# Altium project MiniPDC.PrjPcb
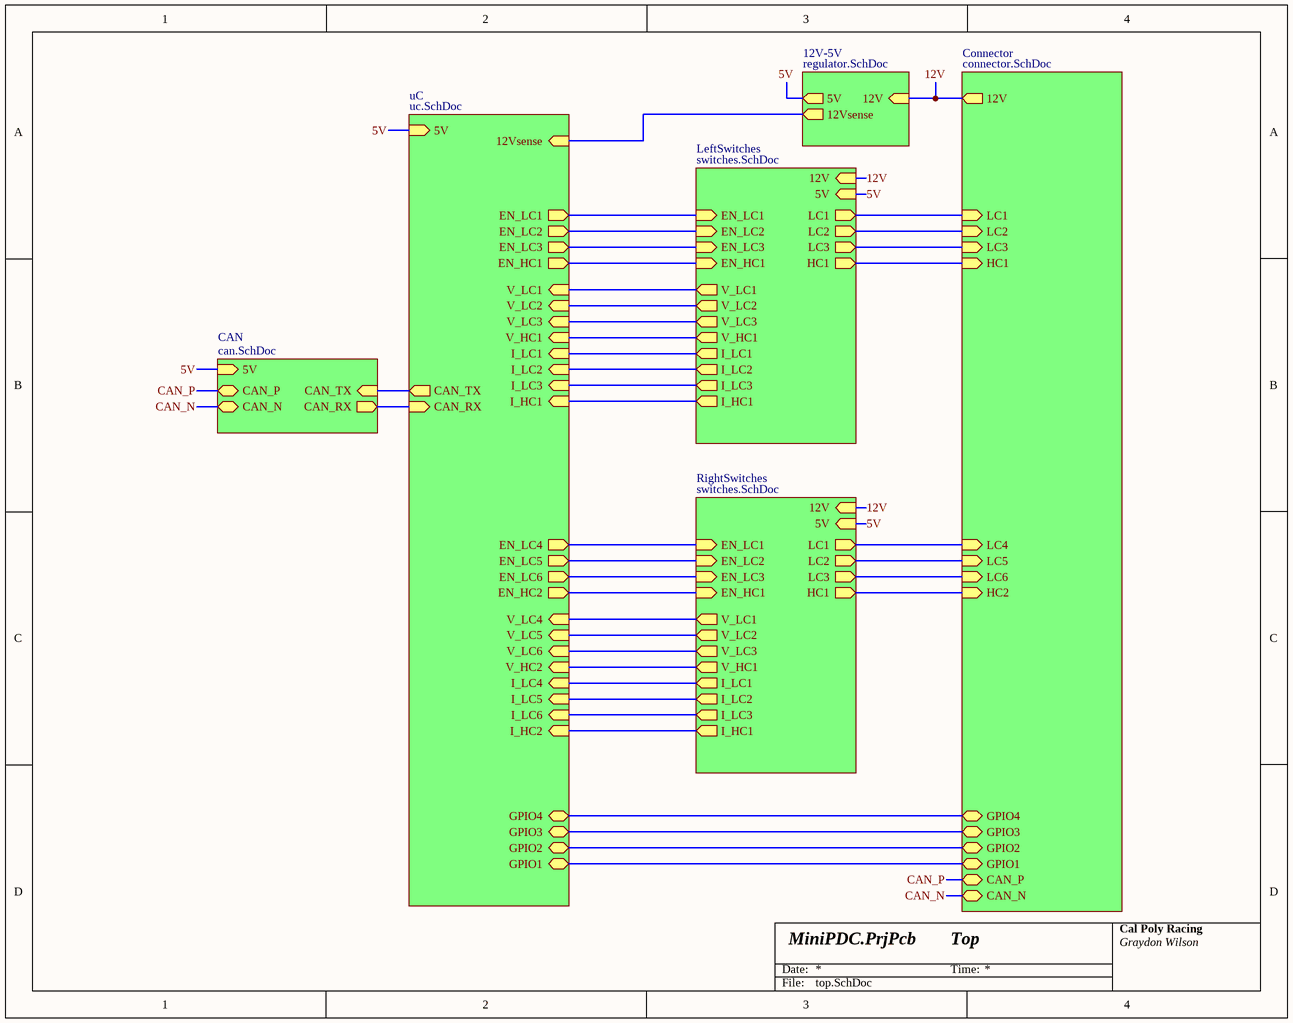
[diagram p0: top.SchDoc]
7 sheets, 120 parts. Net scope: hierarchical (ports join the sheet entries above them; power ports are global).
Board file: rev1_0.PcbDoc
Sheets:
  top.SchDoc
    CAN = can.SchDoc
    uC = uc.SchDoc
    LeftSwitches = switches.SchDoc
      Switch1 = switch.SchDoc
      Switch2 = switch.SchDoc
      Switch3 = switch.SchDoc
      Switch4 = switch.SchDoc
    Connector = connector.SchDoc
    12V-5V = regulator.SchDoc
    RightSwitches = switches.SchDoc
      Switch1 = switch.SchDoc
      Switch2 = switch.SchDoc
      Switch3 = switch.SchDoc
      Switch4 = switch.SchDoc

## Sheet top.SchDoc: Top
size A; Organization: Cal Poly Racing; engineer1: Graydon Wilson

### Sub-sheets
12V-5V = regulator.SchDoc: 12V (in), 5V (out), 12Vsense (out)
CAN = can.SchDoc: 5V (in), CAN_P (bidir), CAN_N (bidir), CAN_TX (in), CAN_RX (out)
Connector = connector.SchDoc: 12V (out), LC1 (in), LC2 (in), LC3 (in), HC1 (in), CAN_P (bidir), CAN_N (bidir), LC4 (in), LC5 (in), LC6 (in), HC2 (in), GPIO4 (bidir), GPIO2 (bidir), GPIO1 (bidir), GPIO3 (bidir)
LeftSwitches = switches.SchDoc: LC1 (out), LC2 (out), LC3 (out), HC1 (out), I_LC1 (out), I_LC2 (out), I_LC3 (out), I_HC1 (out), V_HC1 (out), V_LC3 (out), V_LC2 (out), V_LC1 (out), EN_LC1 (in), EN_LC2 (in), EN_LC3 (in), EN_HC1 (in), 12V (in), 5V (in)
RightSwitches = switches.SchDoc: LC1 (out), LC2 (out), LC3 (out), HC1 (out), I_LC1 (out), I_LC2 (out), I_LC3 (out), I_HC1 (out), V_HC1 (out), V_LC3 (out), V_LC2 (out), V_LC1 (out), EN_LC1 (in), EN_LC2 (in), EN_LC3 (in), EN_HC1 (in), 12V (in), 5V (in)
uC = uc.SchDoc: CAN_TX (out), 5V (in), CAN_RX (in), EN_LC1 (out), EN_LC2 (out), EN_LC3 (out), EN_HC1 (out), V_LC1 (in), V_LC2 (in), V_LC3 (in), V_HC1 (in), I_LC1 (in), I_LC2 (in), I_LC3 (in), I_HC1 (in), EN_LC4 (out), EN_LC5 (out), EN_LC6 (out), EN_HC2 (out), V_LC4 (in), V_LC5 (in), V_LC6 (in), V_HC2 (in), I_LC4 (in), I_LC5 (in), I_LC6 (in), I_HC2 (in), GPIO1 (bidir), GPIO2 (bidir), GPIO3 (bidir), GPIO4 (bidir), 12Vsense (in)

### Nets
5V: sheet CAN/5V, sheet uC/5V, sheet LeftSwitches/5V, sheet 12V-5V/5V, sheet RightSwitches/5V
12V: sheet LeftSwitches/12V, sheet Connector/12V, sheet 12V-5V/12V, sheet RightSwitches/12V
CAN_N: sheet CAN/CAN_N, sheet Connector/CAN_N
CAN_P: sheet CAN/CAN_P, sheet Connector/CAN_P
NetQ1_1: sheet LeftSwitches/LC1, sheet Connector/LC1
NetQ2_1: sheet Connector/LC4, sheet RightSwitches/LC1
NetQ3_1: sheet LeftSwitches/LC2, sheet Connector/LC2
NetQ4_1: sheet Connector/LC5, sheet RightSwitches/LC2
NetQ5_1: sheet LeftSwitches/LC3, sheet Connector/LC3
NetQ6_1: sheet Connector/LC6, sheet RightSwitches/LC3
NetQ7_1: sheet LeftSwitches/HC1, sheet Connector/HC1
NetQ8_1: sheet Connector/HC2, sheet RightSwitches/HC1
NetR3_2: sheet uC/I_LC1, sheet LeftSwitches/I_LC1
NetR7_1: sheet uC/V_LC1, sheet LeftSwitches/V_LC1
NetR10_2: sheet uC/I_LC4, sheet RightSwitches/I_LC1
NetR14#2_1: sheet uC/V_LC4, sheet RightSwitches/V_LC1
NetR15#1_1: sheet uC/12Vsense, sheet 12V-5V/12Vsense
NetR17_2: sheet uC/I_LC2, sheet LeftSwitches/I_LC2
NetR21_1: sheet uC/V_LC2, sheet LeftSwitches/V_LC2
NetR24_2: sheet uC/I_LC5, sheet RightSwitches/I_LC2
NetR28_1: sheet uC/V_LC5, sheet RightSwitches/V_LC2
NetR31_2: sheet uC/I_LC3, sheet LeftSwitches/I_LC3
NetR35_1: sheet uC/V_LC3, sheet LeftSwitches/V_LC3
NetR38_2: sheet uC/I_LC6, sheet RightSwitches/I_LC3
NetR42_1: sheet uC/V_LC6, sheet RightSwitches/V_LC3
NetR45_2: sheet uC/I_HC1, sheet LeftSwitches/I_HC1
NetR49_1: sheet uC/V_HC1, sheet LeftSwitches/V_HC1
NetR52_2: sheet uC/I_HC2, sheet RightSwitches/I_HC1
NetR56_1: sheet uC/V_HC2, sheet RightSwitches/V_HC1
NetR58_2: sheet uC/EN_LC1, sheet LeftSwitches/EN_LC1
NetR59_2: sheet uC/EN_LC2, sheet LeftSwitches/EN_LC2
NetR60_2: sheet uC/EN_LC3, sheet LeftSwitches/EN_LC3
NetR61_2: sheet uC/EN_HC1, sheet LeftSwitches/EN_HC1
NetR62_2: sheet uC/EN_LC4, sheet RightSwitches/EN_LC1
NetR63_2: sheet uC/EN_LC5, sheet RightSwitches/EN_LC2
NetR64_2: sheet uC/EN_LC6, sheet RightSwitches/EN_LC3
NetR65_2: sheet uC/EN_HC2, sheet RightSwitches/EN_HC1
NetU4#1_1: sheet CAN/CAN_TX, sheet uC/CAN_TX
NetU4#1_4: sheet CAN/CAN_RX, sheet uC/CAN_RX
NetU5#1_49: sheet uC/GPIO1, sheet Connector/GPIO1
NetU5#1_50: sheet uC/GPIO2, sheet Connector/GPIO2
NetU5#1_51: sheet uC/GPIO3, sheet Connector/GPIO3
NetU5#1_52: sheet uC/GPIO4, sheet Connector/GPIO4

### Notes on the sheet
- Date:
- Time:
- File:

## Sheet can.SchDoc: CAN
size A; Organization: Cal Poly Racing; engineer1: Graydon Wilson
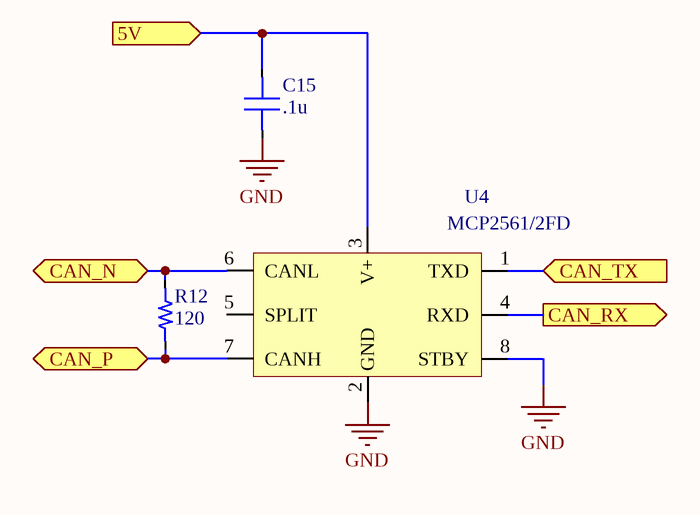
[diagram p1: can.SchDoc]

### Parts
(Parts that share a designator on the sheet are numbered #1, #2 ... from top to bottom, then left to right.)
C15#1  value .1u  [0603_CAP]  (hidden comment: Capacitor)
R12#1  value 120  [0603_RES]  (hidden comment: Resistor)
U4#1  MCP2561/2FD  [SOIC-8]

### Ports
5V (in), CAN_N (bidir), CAN_P (bidir), CAN_RX (out), CAN_TX (in)

### Nets
GND: C15#1.2 U4#1.2(GND) U4#1.8(STBY)
5V: C15#1.1 U4#1.3(V+) ; port 5V
CAN_N: R12#1.2 U4#1.6(CANL) ; port CAN_N
CAN_P: R12#1.1 U4#1.7(CANH) ; port CAN_P
NetU4#1_1: U4#1.1(TXD) ; port CAN_TX
NetU4#1_4: U4#1.4(RXD) ; port CAN_RX

Not connected (* = marked no-connect by the designer): U4#1 5(SPLIT)

### Notes on the sheet
- Date:
- Time:
- File:

### Library data of the parts
U4#1 = MCP2561/2FD: 1/1 Transceiver CANbus; Vcc: 5; Name: MCP2561/2FD; Type: CAN; ComponentLink1Description: Digikey; ComponentLink1URL: https://www.digikey.com/product-detail/en/microchip-technology/MCP2561FDT-E-SN/MCP2561FDT-E-SNCT-ND/8637243; ComponentLink2Description: Datasheet; ComponentLink2URL: http://ww1.microchip.com/downloads/en/DeviceDoc/20005284A.pdf
R12 = Resistor: Tolerance: *

## Sheet uc.SchDoc: Controller
size A; Organization: Cal Poly Racing; engineer1: Graydon Wilson
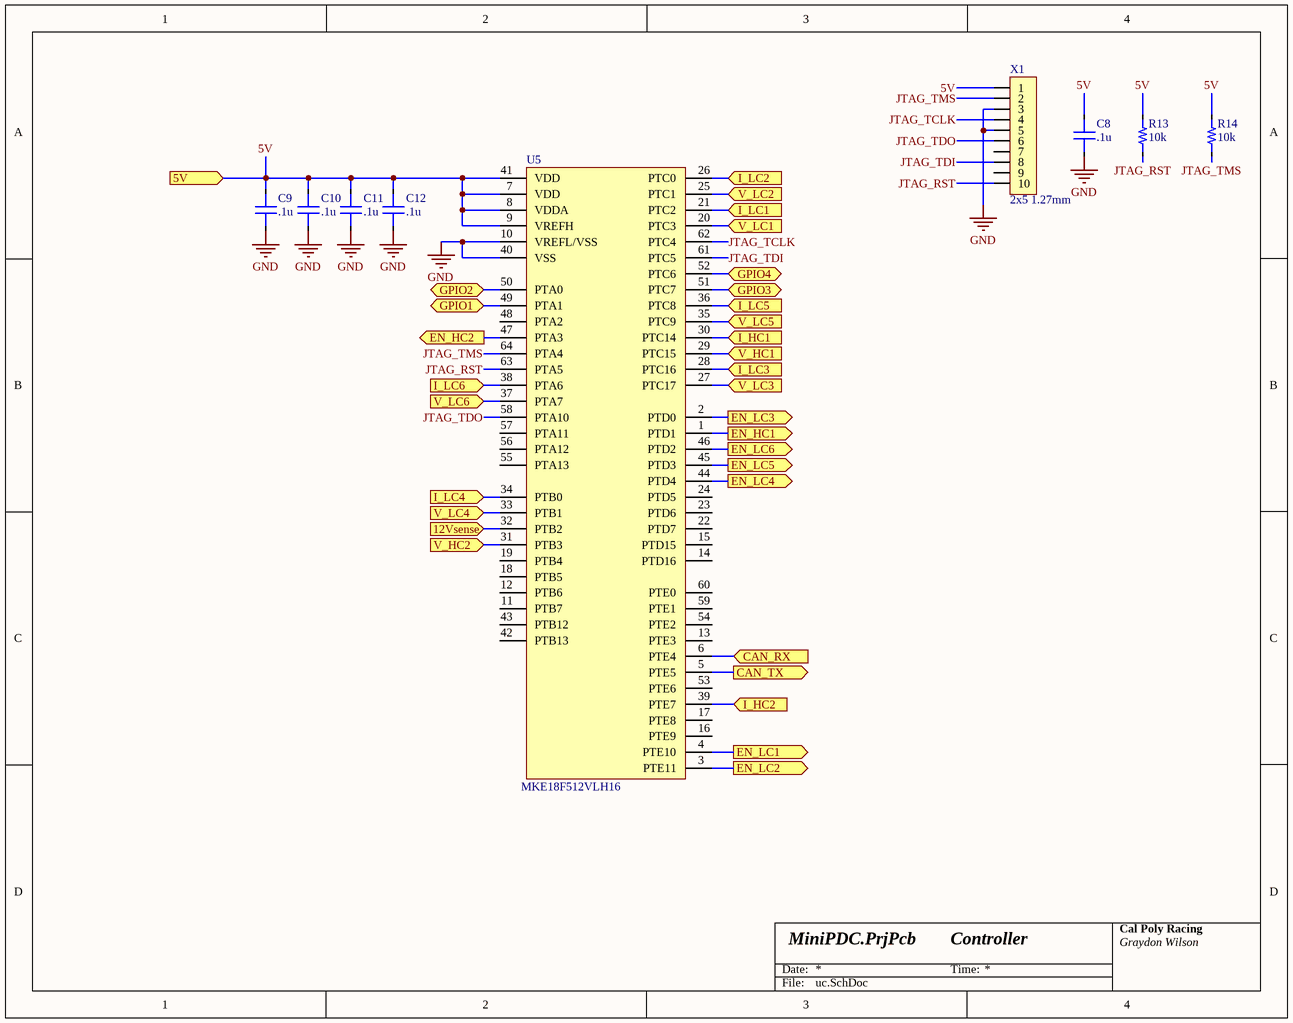
[diagram p2: uc.SchDoc]

### Parts
(Parts that share a designator on the sheet are numbered #1, #2 ... from top to bottom, then left to right.)
C8#1  value .1u  [0603_CAP]  (hidden comment: Capacitor)
C9#1  value .1u  [0603_CAP]  (hidden comment: Capacitor)
C10#1  value .1u  [0603_CAP]  (hidden comment: Capacitor)
C11#1  value .1u  [0603_CAP]  (hidden comment: Capacitor)
C12#1  value .1u  [0603_CAP]  (hidden comment: Capacitor)
R13#1  value 10k  [0603_RES]  (hidden comment: Resistor)
R14#1  value 10k  [0603_RES]  (hidden comment: Resistor)
U5#1  MKE18F512VLH16  [TQFP64]
X1  2x5 1.27mm  [2x5 1.27mm th]

### Ports
5V (in), 12Vsense (in), CAN_RX (in), CAN_TX (out), EN_HC1 (out), EN_HC2 (out), EN_LC1 (out), EN_LC2 (out), EN_LC3 (out), EN_LC4 (out), EN_LC5 (out), EN_LC6 (out), GPIO1 (bidir), GPIO2 (bidir), GPIO3 (bidir), GPIO4 (bidir), I_HC1 (in), I_HC2 (in), I_LC1 (in), I_LC2 (in), I_LC3 (in), I_LC4 (in), I_LC5 (in), I_LC6 (in), V_HC1 (in), V_HC2 (in), V_LC1 (in), V_LC2 (in), V_LC3 (in), V_LC4 (in), V_LC5 (in), V_LC6 (in)

### Nets
GND: C8#1.1 C9#1.1 C10#1.1 C11#1.1 C12#1.1 U5#1.10(VREFL/VSS) U5#1.40(VSS) X1.3 X1.5
5V: C8#1.2 C9#1.2 C10#1.2 C11#1.2 C12#1.2 R13#1.2 R14#1.2 U5#1.7(VDD) U5#1.8(VDDA) U5#1.9(VREFH) U5#1.41(VDD) X1.1 ; port 5V
JTAG_RST: R13#1.1 U5#1.63(PTA5) X1.10
JTAG_TCLK: U5#1.62(PTC4) X1.4
JTAG_TDI: U5#1.61(PTC5) X1.8
JTAG_TDO: U5#1.58(PTA10) X1.6
JTAG_TMS: R14#1.1 U5#1.64(PTA4) X1.2
NetR3_2: U5#1.21(PTC2) ; port I_LC1
NetR7_1: U5#1.20(PTC3) ; port V_LC1
NetR10_2: U5#1.34(PTB0) ; port I_LC4
NetR14#2_1: U5#1.33(PTB1) ; port V_LC4
NetR15#1_1: U5#1.32(PTB2) ; port 12Vsense
NetR17_2: U5#1.26(PTC0) ; port I_LC2
NetR21_1: U5#1.25(PTC1) ; port V_LC2
NetR24_2: U5#1.36(PTC8) ; port I_LC5
NetR28_1: U5#1.35(PTC9) ; port V_LC5
NetR31_2: U5#1.28(PTC16) ; port I_LC3
NetR35_1: U5#1.27(PTC17) ; port V_LC3
NetR38_2: U5#1.38(PTA6) ; port I_LC6
NetR42_1: U5#1.37(PTA7) ; port V_LC6
NetR45_2: U5#1.30(PTC14) ; port I_HC1
NetR49_1: U5#1.29(PTC15) ; port V_HC1
NetR52_2: U5#1.39(PTE7) ; port I_HC2
NetR56_1: U5#1.31(PTB3) ; port V_HC2
NetR58_2: U5#1.4(PTE10) ; port EN_LC1
NetR59_2: U5#1.3(PTE11) ; port EN_LC2
NetR60_2: U5#1.2(PTD0) ; port EN_LC3
NetR61_2: U5#1.1(PTD1) ; port EN_HC1
NetR62_2: U5#1.44(PTD4) ; port EN_LC4
NetR63_2: U5#1.45(PTD3) ; port EN_LC5
NetR64_2: U5#1.46(PTD2) ; port EN_LC6
NetR65_2: U5#1.47(PTA3) ; port EN_HC2
NetU4#1_1: U5#1.5(PTE5) ; port CAN_TX
NetU4#1_4: U5#1.6(PTE4) ; port CAN_RX
NetU5#1_49: U5#1.49(PTA1) ; port GPIO1
NetU5#1_50: U5#1.50(PTA0) ; port GPIO2
NetU5#1_51: U5#1.51(PTC7) ; port GPIO3
NetU5#1_52: U5#1.52(PTC6) ; port GPIO4

Not connected (* = marked no-connect by the designer): U5#1 11(PTB7) 12(PTB6) 13(PTE3) 14(PTD16) 15(PTD15) 16(PTE9) 17(PTE8) 18(PTB5) 19(PTB4) 22(PTD7) 23(PTD6) 24(PTD5) 42(PTB13) 43(PTB12) 48(PTA2) 53(PTE6) 54(PTE2) 55(PTA13) 56(PTA12) 57(PTA11) 59(PTE1) 60(PTE0); X1 7 9

### Notes on the sheet
- Date:
- Time:
- File:

### Library data of the parts
U5#1 = MKE18F512VLH16: Vcc: 2.7-5.5; Package: TQFP64
X1 = 2x5 1.27mm: Circuits: 10; Name: 2x5 1.27mm; ComponentLink1Description: Digikey; ComponentLink1URL: https://www.digikey.com/product-detail/en/samtec-inc/FTSH-105-01-F-D-K/SAM8909-ND/1850757
C8-C12 = Capacitor: Dielectric: *; Percent Tolerance: *; ESR: *
R13 R14 = Resistor: Tolerance: *

## Sheet switches.SchDoc: Quad Switch
size A; Organization: Cal Poly Racing; engineer1: Graydon Wilson
Used 2 times, as channels LeftSwitches, RightSwitches. Parts and nets are listed once, with the designators drawn on the sheet.
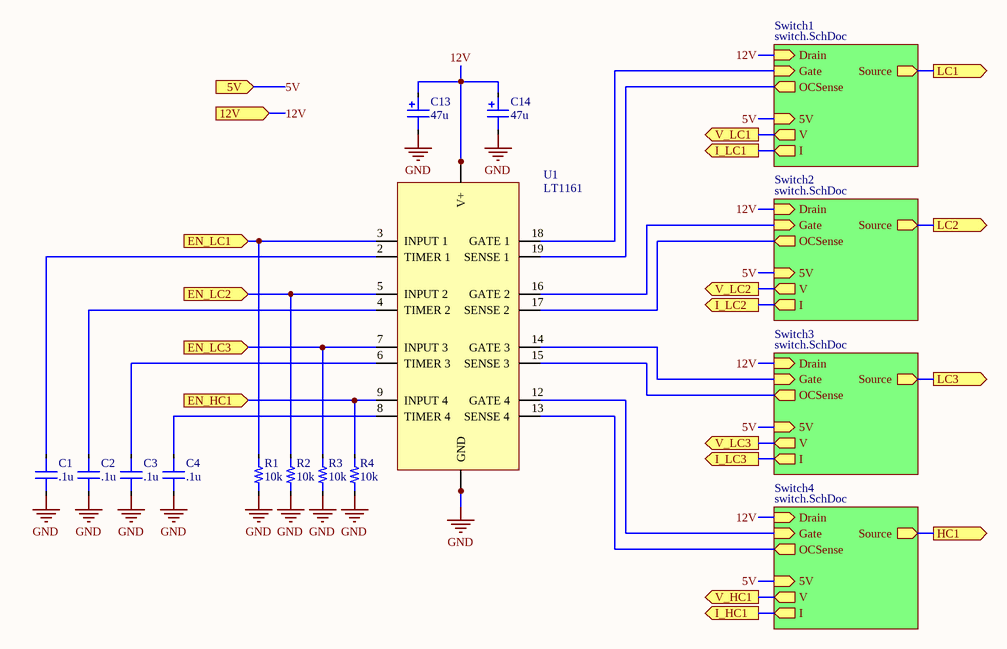
[diagram p3: switches.SchDoc]

### Parts
C1  value .1u  [0603_CAP]  (hidden comment: Capacitor)
C2  value .1u  [0603_CAP]  (hidden comment: Capacitor)
C3  value .1u  [0603_CAP]  (hidden comment: Capacitor)
C4  value .1u  [0603_CAP]  (hidden comment: Capacitor)
C13  value 47u  [CAPAE6666X77M]  (hidden comment: UWT1H470MCL1GS)
C14  value 47u  [CAPAE6666X77M]  (hidden comment: UWT1H470MCL1GS)
R1  value 10k  [0603_RES]  (hidden comment: Resistor)
R2  value 10k  [0603_RES]  (hidden comment: Resistor)
R3  value 10k  [0603_RES]  (hidden comment: Resistor)
R4  value 10k  [0603_RES]  (hidden comment: Resistor)
U1  LT1161  [SO-20]

### Sub-sheets
Switch1 = switch.SchDoc: 5V (in), I (out), V (out), OCSense (out), Gate (in), Drain (in), Source (out)
Switch2 = switch.SchDoc: 5V (in), I (out), V (out), OCSense (out), Gate (in), Drain (in), Source (out)
Switch3 = switch.SchDoc: 5V (in), I (out), V (out), OCSense (out), Gate (in), Drain (in), Source (out)
Switch4 = switch.SchDoc: 5V (in), I (out), V (out), OCSense (out), Gate (in), Drain (in), Source (out)

### Ports
5V (in), 12V (in), EN_HC1 (in), EN_LC1 (in), EN_LC2 (in), EN_LC3 (in), HC1 (out), I_HC1 (out), I_LC1 (out), I_LC2 (out), I_LC3 (out), LC1 (out), LC2 (out), LC3 (out), V_HC1 (out), V_LC1 (out), V_LC2 (out), V_LC3 (out)

### Nets
GND: C1.1 C2.1 C3.1 C4.1 C13.2 C14.2 R1.1 R2.1 R3.1 R4.1 U1.1(GND) U1.10(GND)
5V: port 5V, sheet Switch1/5V, sheet Switch2/5V, sheet Switch3/5V, sheet Switch4/5V
12V: C13.1 C14.1 U1.11(V+) U1.20(V+) ; port 12V, sheet Switch1/Drain, sheet Switch2/Drain, sheet Switch3/Drain, sheet Switch4/Drain
EN_HC1: R4.2 U1.9(INPUT_4) ; port EN_HC1
EN_LC1: R1.2 U1.3(INPUT_1) ; port EN_LC1
EN_LC2: R2.2 U1.5(INPUT_2) ; port EN_LC2
EN_LC3: R3.2 U1.7(INPUT_3) ; port EN_LC3
HC1: port HC1, sheet Switch4/Source
I_HC1: port I_HC1, sheet Switch4/I
I_LC1: port I_LC1, sheet Switch1/I
I_LC2: port I_LC2, sheet Switch2/I
I_LC3: port I_LC3, sheet Switch3/I
LC1: port LC1, sheet Switch1/Source
LC2: port LC2, sheet Switch2/Source
LC3: port LC3, sheet Switch3/Source
V_HC1: port V_HC1, sheet Switch4/V
V_LC1: port V_LC1, sheet Switch1/V
V_LC2: port V_LC2, sheet Switch2/V
V_LC3: port V_LC3, sheet Switch3/V
NetC1_2: C1.2 U1.2(TIMER_1)
NetC2_2: C2.2 U1.4(TIMER_2)
NetC3_2: C3.2 U1.6(TIMER_3)
NetC4_2: C4.2 U1.8(TIMER_4)
NetU1_12: U1.12(GATE_4) ; sheet Switch4/Gate
NetU1_13: U1.13(SENSE_4) ; sheet Switch4/OCSense
NetU1_14: U1.14(GATE_3) ; sheet Switch3/Gate
NetU1_15: U1.15(SENSE_3) ; sheet Switch3/OCSense
NetU1_16: U1.16(GATE_2) ; sheet Switch2/Gate
NetU1_17: U1.17(SENSE_2) ; sheet Switch2/OCSense
NetU1_18: U1.18(GATE_1) ; sheet Switch1/Gate
NetU1_19: U1.19(SENSE_1) ; sheet Switch1/OCSense

### Channels
LeftSwitches: designators C1=C14 C2=C15#2 C3=C16 C4=C17 C13=C12#2 C14=C13 R1=R58 R2=R59 R3=R60 R4=R61 U1=U11; ports 5V=5V 12V=12V EN_HC1=NetR61_2 EN_LC1=NetR58_2 EN_LC2=NetR59_2 EN_LC3=NetR60_2 HC1=NetQ7_1 I_HC1=NetR45_2 I_LC1=NetR3_2 I_LC2=NetR17_2 I_LC3=NetR31_2 LC1=NetQ1_1 LC2=NetQ3_1 LC3=NetQ5_1 V_HC1=NetR49_1 V_LC1=NetR7_1 V_LC2=NetR21_1 V_LC3=NetR35_1
RightSwitches: designators C1=C20 C2=C21 C3=C22 C4=C23 C13=C18 C14=C19 R1=R62 R2=R63 R3=R64 R4=R65 U1=U12; ports 5V=5V 12V=12V EN_HC1=NetR65_2 EN_LC1=NetR62_2 EN_LC2=NetR63_2 EN_LC3=NetR64_2 HC1=NetQ8_1 I_HC1=NetR52_2 I_LC1=NetR10_2 I_LC2=NetR24_2 I_LC3=NetR38_2 LC1=NetQ2_1 LC2=NetQ4_1 LC3=NetQ6_1 V_HC1=NetR56_1 V_LC1=NetR14#2_1 V_LC2=NetR28_1 V_LC3=NetR42_1

### Notes on the sheet
- Date:
- Time:
- File:

### Library data of the parts
C13 C14 = UWT1H470MCL1GS: CAP ALUM 47UF 20% 50V SMD; Dielectric: Aluminum Electrolytic; Vmax: 50; Percent Tolerance: 20%
C1-C4 = Capacitor: Dielectric: *; Percent Tolerance: *; ESR: *
R1-R4 = Resistor: Tolerance: *
U1 = LT1161: Name: LT1161; ComponentLink1Description: Datasheet; ComponentLink1URL: https://www.analog.com/media/en/technical-documentation/data-sheets/1161fa.pdf; ComponentLink2Description: Digikey; ComponentLink2URL: https://www.digikey.com/product-detail/en/linear-technology-analog-devices/LT1161ISW-PBF/LT1161ISW-PBF-ND/888528

## Sheet switch.SchDoc: High Side Switch
size A; Organization: Cal Poly Racing; engineer1: Graydon Wilson
Used 8 times, as channels LeftSwitches/Switch1, LeftSwitches/Switch2, LeftSwitches/Switch3, LeftSwitches/Switch4, RightSwitches/Switch1, RightSwitches/Switch2, RightSwitches/Switch3, RightSwitches/Switch4. Parts and nets are listed once, with the designators drawn on the sheet.
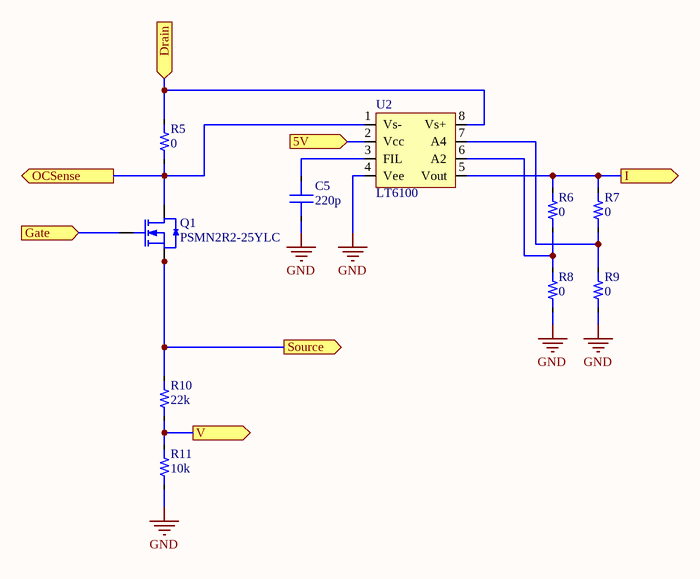
[diagram p4: switch.SchDoc]

### Parts
C5  value 220p  [0603_CAP]  (hidden comment: Capacitor)
Q1  PSMN2R2-25YLC  [LFPAK-SO8]
R5  value 0  [2010]  (hidden comment: Resistor)
R6  value 0  [0603_RES]  (hidden comment: Resistor)
R7  value 0  [0603_RES]  (hidden comment: Resistor)
R8  value 0  [0603_RES]  (hidden comment: Resistor)
R9  value 0  [0603_RES]  (hidden comment: Resistor)
R10  value 22k  [0603_RES]  (hidden comment: Resistor)
R11  value 10k  [0603_RES]  (hidden comment: Resistor)
U2  LT6100  [MSOP-8]

### Ports
5V (in), Drain (in), Gate (in), I (out), OCSense (out), Source (out), V (out)

### Nets
GND: C5.1 R8.1 R9.1 R11.1 U2.4(Vee)
5V: U2.2(Vcc) ; port 5V
Drain: R5.2 U2.8(Vs+) ; port Drain
Gate: Q1.4(G) ; port Gate
I: R6.2 R7.2 U2.5(Vout) ; port I
OCSense: Q1.5(D) R5.1 U2.1(Vs-) ; port OCSense
Source: Q1.1(S) Q1.2(S) Q1.3(S) R10.2 ; port Source
V: R10.1 R11.2 ; port V
NetC5_2: C5.2 U2.3(FIL)
NetR6_1: R6.1 R8.2 U2.6(A2)
NetR7_1: R7.1 R9.2 U2.7(A4)

### Channels
LeftSwitches/Switch1: designators C5=C4 Q1=Q1 R5=R2 R6=R3 R7=R4 R8=R5 R9=R6 R10=R7 R11=R8 U2=U3#1; ports 5V=5V Drain=12V Gate=NetQ1_4 I=NetR3_2 OCSense=NetQ1_5 Source=NetQ1_1 V=NetR7_1
LeftSwitches/Switch2: designators C5=C6#1 Q1=Q3 R5=R16#1 R6=R17 R7=R18 R8=R19 R9=R20 R10=R21 R11=R22 U2=U5#2; ports 5V=5V Drain=12V Gate=NetQ3_4 I=NetR17_2 OCSense=NetQ3_5 Source=NetQ3_1 V=NetR21_1
LeftSwitches/Switch3: designators C5=C8#2 Q1=Q5 R5=R30 R6=R31 R7=R32 R8=R33 R9=R34 R10=R35 R11=R36 U2=U7; ports 5V=5V Drain=12V Gate=NetQ5_4 I=NetR31_2 OCSense=NetQ5_5 Source=NetQ5_1 V=NetR35_1
LeftSwitches/Switch4: designators C5=C10#2 Q1=Q7 R5=R44 R6=R45 R7=R46 R8=R47 R9=R48 R10=R49 R11=R50 U2=U9; ports 5V=5V Drain=12V Gate=NetQ7_4 I=NetR45_2 OCSense=NetQ7_5 Source=NetQ7_1 V=NetR49_1
RightSwitches/Switch1: designators C5=C5 Q1=Q2 R5=R9 R6=R10 R7=R11 R8=R12#2 R9=R13#2 R10=R14#2 R11=R15#2 U2=U4#2; ports 5V=5V Drain=12V Gate=NetQ2_4 I=NetR10_2 OCSense=NetQ2_5 Source=NetQ2_1 V=NetR14#2_1
RightSwitches/Switch2: designators C5=C7#2 Q1=Q4 R5=R23 R6=R24 R7=R25 R8=R26 R9=R27 R10=R28 R11=R29 U2=U6; ports 5V=5V Drain=12V Gate=NetQ4_4 I=NetR24_2 OCSense=NetQ4_5 Source=NetQ4_1 V=NetR28_1
RightSwitches/Switch3: designators C5=C9#2 Q1=Q6 R5=R37 R6=R38 R7=R39 R8=R40 R9=R41 R10=R42 R11=R43 U2=U8; ports 5V=5V Drain=12V Gate=NetQ6_4 I=NetR38_2 OCSense=NetQ6_5 Source=NetQ6_1 V=NetR42_1
RightSwitches/Switch4: designators C5=C11#2 Q1=Q8 R5=R51 R6=R52 R7=R53 R8=R54 R9=R55 R10=R56 R11=R57 U2=U10; ports 5V=5V Drain=12V Gate=NetQ8_4 I=NetR52_2 OCSense=NetQ8_5 Source=NetQ8_1 V=NetR56_1

### Notes on the sheet
- Date:
- Time:
- File:

### Library data of the parts
Q1 = PSMN2R2-25YLC: N-channel 25 V 2.4 mΩ logic level MOSFET in LFPAK using NextPower; Type: N; VdsMax: 25; IdsMax: 100; RdsOnMax: 3.15m; Vt: 1.54; VgsMax: 20; ComponentLink1Description: Datasheet; ComponentLink1URL: https://assets.nexperia.com/documents/data-sheet/PSMN2R2-25YLC.pdf; ComponentLink2Description: Digikey; ComponentLink2URL: https://www.digikey.com/product-detail/en/nexperia-usa-inc/PSMN2R2-25YLC115/1727-5299-1-ND/2674299; Name: PSMN2R2-25YLC
U2 = LT6100: High Side Current Sense Amp; Name: LT6100; ComponentLink1Description: Datasheet; ComponentLink1URL: https://www.analog.com/media/en/technical-documentation/data-sheets/6100fd.pdf; ComponentLink2Description: Digikey; ComponentLink2URL: https://www.digikey.com/product-detail/en/linear-technology-analog-devices/LT6100CMS8-TRPBF/LT6100CMS8-TRPBFCT-ND/7917234
C5 = Capacitor: Dielectric: *; Percent Tolerance: *; ESR: *
R5-R11 = Resistor: Tolerance: *

## Sheet connector.SchDoc
size A
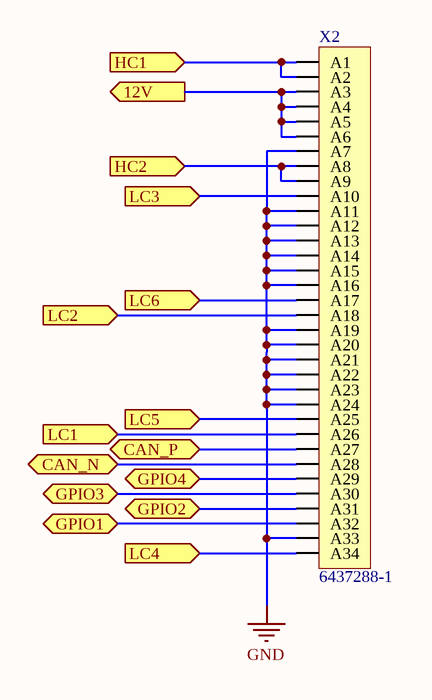
[diagram p5: connector.SchDoc]

### Parts
X2  6437288-1  [6437288-1]

### Ports
12V (out), CAN_N (bidir), CAN_P (bidir), GPIO1 (bidir), GPIO2 (bidir), GPIO3 (bidir), GPIO4 (bidir), HC1 (in), HC2 (in), LC1 (in), LC2 (in), LC3 (in), LC4 (in), LC5 (in), LC6 (in)

### Nets
GND: X2.A7 X2.A11 X2.A12 X2.A13 X2.A14 X2.A15 X2.A16 X2.A19 X2.A20 X2.A21 X2.A22 X2.A23 X2.A24 X2.A33
12V: X2.A3 X2.A4 X2.A5 X2.A6 ; port 12V
CAN_N: X2.A28 ; port CAN_N
CAN_P: X2.A27 ; port CAN_P
NetQ1_1: X2.A26 ; port LC1
NetQ2_1: X2.A34 ; port LC4
NetQ3_1: X2.A18 ; port LC2
NetQ4_1: X2.A25 ; port LC5
NetQ5_1: X2.A10 ; port LC3
NetQ6_1: X2.A17 ; port LC6
NetQ7_1: X2.A1 X2.A2 ; port HC1
NetQ8_1: X2.A8 X2.A9 ; port HC2
NetU5#1_49: X2.A32 ; port GPIO1
NetU5#1_50: X2.A31 ; port GPIO2
NetU5#1_51: X2.A30 ; port GPIO3
NetU5#1_52: X2.A29 ; port GPIO4

### Library data of the parts
X2 = 6437288-1: Superseal 34P; Circuits: 34; Name: 6437288-1; ComponentLink1Description: Digikey; ComponentLink1URL: https://www.digikey.com/products/en?mpart=6437288-1&&csp=WT.z_cid%3Dsp_8004_20120425_buynow%26TE_cid%3D8004-1541898693362

## Sheet regulator.SchDoc: Linear Regulator
size A; Organization: Cal Poly Racing; engineer1: Graydon Wilson
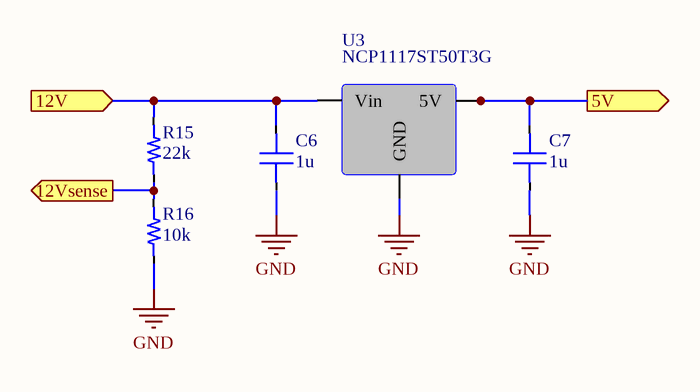
[diagram p6: regulator.SchDoc]

### Parts
(Parts that share a designator on the sheet are numbered #1, #2 ... from top to bottom, then left to right.)
C6#2  value 1u  [0603_CAP]  (hidden comment: Capacitor)
C7#1  value 1u  [0603_CAP]  (hidden comment: Capacitor)
R15#1  value 22k  [0603_RES]  (hidden comment: Resistor)
R16#2  value 10k  [0603_RES]  (hidden comment: Resistor)
U3#2  NCP1117ST50T3G  [SOT-223-4]

### Ports
5V (out), 12V (in), 12Vsense (out)

### Nets
GND: C6#2.1 C7#1.1 R16#2.1 U3#2.1(GND)
5V: C7#1.2 U3#2.2(5V) U3#2.4(Tab) ; port 5V
12V: C6#2.2 R15#1.2 U3#2.3(Vin) ; port 12V
NetR15#1_1: R15#1.1 R16#2.2 ; port 12Vsense

### Notes on the sheet
- Date:
- Time:
- File:

### Library data of the parts
U3#2 = NCP1117ST50T3G: Vout: 5; Name: NCP1117ST50T3G; Type: Linear fixed; ComponentLink1Description: Digikey; ComponentLink1URL: https://www.digikey.com/product-detail/en/on-semiconductor/NCP1117ST50T3G/NCP1117ST50T3GOSCT-ND/1967217; ComponentLink2Description: Datasheet; ComponentLink2URL: https://www.onsemi.com/pub/Collateral/NCP1117-D.PDF
C6 C7 = Capacitor: Dielectric: *; Percent Tolerance: *; ESR: *
R15 R16 = Resistor: Tolerance: *

## Nets that join several sheets
GND: can (C15#1.2 U4#1.2 U4#1.8), uc (9 pins), LeftSwitches (12 pins), LeftSwitches/Switch1 (5 pins), LeftSwitches/Switch2 (5 pins), LeftSwitches/Switch3 (5 pins), LeftSwitches/Switch4 (5 pins), connector (14 pins), regulator (C6#2.1 C7#1.1 R16#2.1 U3#2.1), RightSwitches (12 pins), RightSwitches/Switch1 (5 pins), RightSwitches/Switch2 (5 pins), RightSwitches/Switch3 (5 pins), RightSwitches/Switch4 (5 pins)
5V: can (C15#1.1 U4#1.3), uc (12 pins), LeftSwitches/Switch1 (U3#1.2), LeftSwitches/Switch2 (U5#2.2), LeftSwitches/Switch3 (U7.2), LeftSwitches/Switch4 (U9.2), regulator (C7#1.2 U3#2.2 U3#2.4), RightSwitches/Switch1 (U4#2.2), RightSwitches/Switch2 (U6.2), RightSwitches/Switch3 (U8.2), RightSwitches/Switch4 (U10.2)
12V: LeftSwitches (C12#2.1 C13.1 U11.11 U11.20), LeftSwitches/Switch1 (R2.2 U3#1.8), LeftSwitches/Switch2 (R16#1.2 U5#2.8), LeftSwitches/Switch3 (R30.2 U7.8), LeftSwitches/Switch4 (R44.2 U9.8), connector (X2.A3 X2.A4 X2.A5 X2.A6), regulator (C6#2.2 R15#1.2 U3#2.3), RightSwitches (C18.1 C19.1 U12.11 U12.20), RightSwitches/Switch1 (R9.2 U4#2.8), RightSwitches/Switch2 (R23.2 U6.8), RightSwitches/Switch3 (R37.2 U8.8), RightSwitches/Switch4 (R51.2 U10.8)
CAN_N: can (R12#1.2 U4#1.6), connector (X2.A28)
CAN_P: can (R12#1.1 U4#1.7), connector (X2.A27)
NetQ1_1: LeftSwitches/Switch1 (Q1.1 Q1.2 Q1.3 R7.2), connector (X2.A26)
NetQ1_4: LeftSwitches (U11.18), LeftSwitches/Switch1 (Q1.4)
NetQ1_5: LeftSwitches (U11.19), LeftSwitches/Switch1 (Q1.5 R2.1 U3#1.1)
NetQ2_1: connector (X2.A34), RightSwitches/Switch1 (Q2.1 Q2.2 Q2.3 R14#2.2)
NetQ2_4: RightSwitches (U12.18), RightSwitches/Switch1 (Q2.4)
NetQ2_5: RightSwitches (U12.19), RightSwitches/Switch1 (Q2.5 R9.1 U4#2.1)
NetQ3_1: LeftSwitches/Switch2 (Q3.1 Q3.2 Q3.3 R21.2), connector (X2.A18)
NetQ3_4: LeftSwitches (U11.16), LeftSwitches/Switch2 (Q3.4)
NetQ3_5: LeftSwitches (U11.17), LeftSwitches/Switch2 (Q3.5 R16#1.1 U5#2.1)
NetQ4_1: connector (X2.A25), RightSwitches/Switch2 (Q4.1 Q4.2 Q4.3 R28.2)
NetQ4_4: RightSwitches (U12.16), RightSwitches/Switch2 (Q4.4)
NetQ4_5: RightSwitches (U12.17), RightSwitches/Switch2 (Q4.5 R23.1 U6.1)
NetQ5_1: LeftSwitches/Switch3 (Q5.1 Q5.2 Q5.3 R35.2), connector (X2.A10)
NetQ5_4: LeftSwitches (U11.14), LeftSwitches/Switch3 (Q5.4)
NetQ5_5: LeftSwitches (U11.15), LeftSwitches/Switch3 (Q5.5 R30.1 U7.1)
NetQ6_1: connector (X2.A17), RightSwitches/Switch3 (Q6.1 Q6.2 Q6.3 R42.2)
NetQ6_4: RightSwitches (U12.14), RightSwitches/Switch3 (Q6.4)
NetQ6_5: RightSwitches (U12.15), RightSwitches/Switch3 (Q6.5 R37.1 U8.1)
NetQ7_1: LeftSwitches/Switch4 (Q7.1 Q7.2 Q7.3 R49.2), connector (X2.A1 X2.A2)
NetQ7_4: LeftSwitches (U11.12), LeftSwitches/Switch4 (Q7.4)
NetQ7_5: LeftSwitches (U11.13), LeftSwitches/Switch4 (Q7.5 R44.1 U9.1)
NetQ8_1: connector (X2.A8 X2.A9), RightSwitches/Switch4 (Q8.1 Q8.2 Q8.3 R56.2)
NetQ8_4: RightSwitches (U12.12), RightSwitches/Switch4 (Q8.4)
NetQ8_5: RightSwitches (U12.13), RightSwitches/Switch4 (Q8.5 R51.1 U10.1)
NetR3_2: uc (U5#1.21), LeftSwitches/Switch1 (R3.2 R4.2 U3#1.5)
NetR7_1: uc (U5#1.20), LeftSwitches/Switch1 (R7.1 R8.2)
NetR10_2: uc (U5#1.34), RightSwitches/Switch1 (R10.2 R11.2 U4#2.5)
NetR14#2_1: uc (U5#1.33), RightSwitches/Switch1 (R14#2.1 R15#2.2)
NetR15#1_1: uc (U5#1.32), regulator (R15#1.1 R16#2.2)
NetR17_2: uc (U5#1.26), LeftSwitches/Switch2 (R17.2 R18.2 U5#2.5)
NetR21_1: uc (U5#1.25), LeftSwitches/Switch2 (R21.1 R22.2)
NetR24_2: uc (U5#1.36), RightSwitches/Switch2 (R24.2 R25.2 U6.5)
NetR28_1: uc (U5#1.35), RightSwitches/Switch2 (R28.1 R29.2)
NetR31_2: uc (U5#1.28), LeftSwitches/Switch3 (R31.2 R32.2 U7.5)
NetR35_1: uc (U5#1.27), LeftSwitches/Switch3 (R35.1 R36.2)
NetR38_2: uc (U5#1.38), RightSwitches/Switch3 (R38.2 R39.2 U8.5)
NetR42_1: uc (U5#1.37), RightSwitches/Switch3 (R42.1 R43.2)
NetR45_2: uc (U5#1.30), LeftSwitches/Switch4 (R45.2 R46.2 U9.5)
NetR49_1: uc (U5#1.29), LeftSwitches/Switch4 (R49.1 R50.2)
NetR52_2: uc (U5#1.39), RightSwitches/Switch4 (R52.2 R53.2 U10.5)
NetR56_1: uc (U5#1.31), RightSwitches/Switch4 (R56.1 R57.2)
NetR58_2: uc (U5#1.4), LeftSwitches (R58.2 U11.3)
NetR59_2: uc (U5#1.3), LeftSwitches (R59.2 U11.5)
NetR60_2: uc (U5#1.2), LeftSwitches (R60.2 U11.7)
NetR61_2: uc (U5#1.1), LeftSwitches (R61.2 U11.9)
NetR62_2: uc (U5#1.44), RightSwitches (R62.2 U12.3)
NetR63_2: uc (U5#1.45), RightSwitches (R63.2 U12.5)
NetR64_2: uc (U5#1.46), RightSwitches (R64.2 U12.7)
NetR65_2: uc (U5#1.47), RightSwitches (R65.2 U12.9)
NetU4#1_1: can (U4#1.1), uc (U5#1.5)
NetU4#1_4: can (U4#1.4), uc (U5#1.6)
NetU5#1_49: uc (U5#1.49), connector (X2.A32)
NetU5#1_50: uc (U5#1.50), connector (X2.A31)
NetU5#1_51: uc (U5#1.51), connector (X2.A30)
NetU5#1_52: uc (U5#1.52), connector (X2.A29)